# Altium schematic sheet hv_psu_v100_LINREG.SchDoc
size A4; SheetNumber: 6; SheetTotal: 7
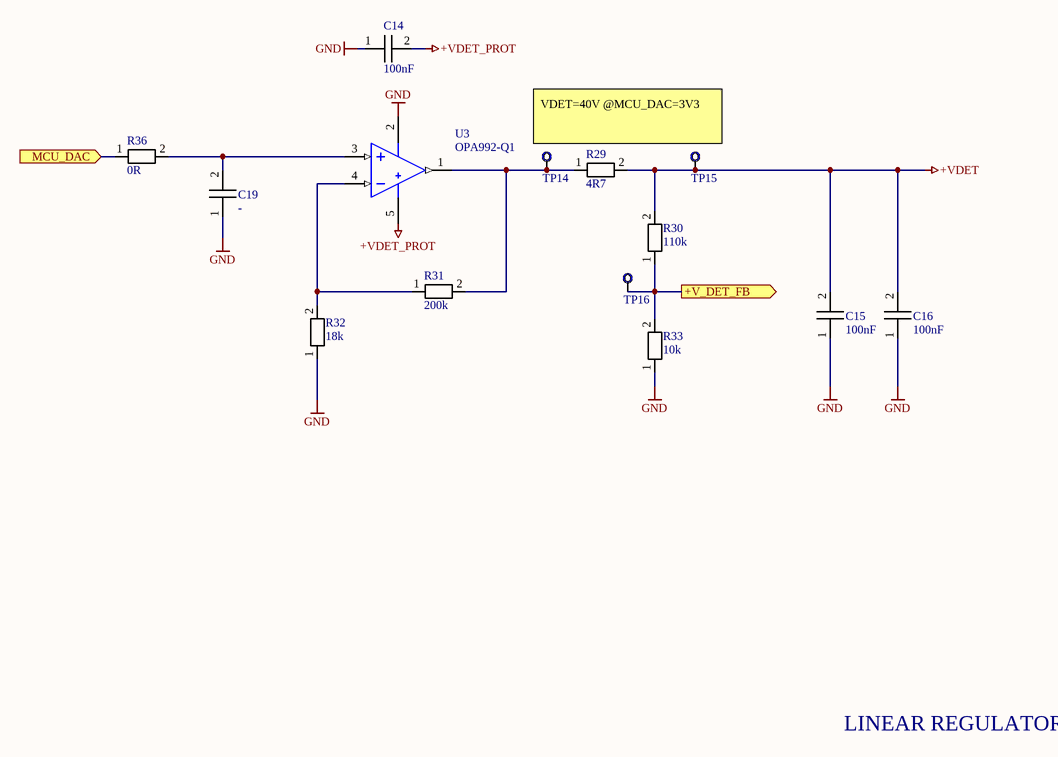
[diagram p0: hv_psu_v100_LINREG.SchDoc]

## Parts
C14  100nF  [1206_C]
C15  100nF  [1206_C]
C16  100nF  [1206_C]
C19  -  [1206_C]
R29  4R7  [1206]
R30  110k  [1206]
R31  200k  [1206]
R32  18k  [1206]
R33  10k  [1206]
R36  0R  [1206]
TP14  ?  [PAD_40]  (value not drawn)  (no BOM)
TP15  ?  [PAD_40]  (value not drawn)  (no BOM)
TP16  ?  [PAD_40]  (value not drawn)  (no BOM)
U3  OPA992-Q1  [SOT23-5]

## Ports
+V_DET_FB (out), MCU_DAC (in)

## Nets
+VDET: C15.2 C16.2 R29.2 R30.2 TP15.1
+VDET_PROT: C14.2 U3.5(V+)
GND: C14.1 C15.1 C16.1 C19.1 R32.1 R33.1 U3.2(V-)
+V_DET_FB: R30.1 R33.2 TP16.1 ; port +V_DET_FB
MCU_DAC: R36.1 ; port MCU_DAC
NetC19_2: C19.2 R36.2 U3.3(IN+)
NetR29_1: R29.1 R31.2 TP14.1 U3.1(OUT)
NetR31_1: R31.1 R32.2 U3.4(IN-)

## Notes on the sheet
- VDET=40V @MCU_DAC=3V3
- LINEAR REGULATOR

## Library data of the parts
C14-C16 C19 = CAPACITOR
R29-R32 R36 = RESISTOR: Parameter 1: 10k
R33 = RESISTOR: Parameter 1: 10k
TP14-TP16 = TESTPOINT
U3 = OPA992-Q1: OPA992-Q1 Automotive, 40-V Rail-to-Rail Input or Output, / Low Offset Voltage, Low Noise Op Amp GBW 10.6MHz; Manufacturer_Name: Texas Instruments; Manufacturer_Part_Number: INA180A2IDBVR; Geometry.Height: 1.45mm; Mouser Part Number: 595-INA180A2IDBVR; Mouser Price/Stock: https://www.mouser.co.uk/ProductDetail/Texas-Instruments/INA180A2IDBVR?qs=5aG0NVq1C4wYcJfa99BoHg%3D%3D; Datasheet Link: http://www.ti.com/lit/ds/symlink/ina180.pdf